# EAGLE design cnc_1_0_0 (EAGLE 6.2)
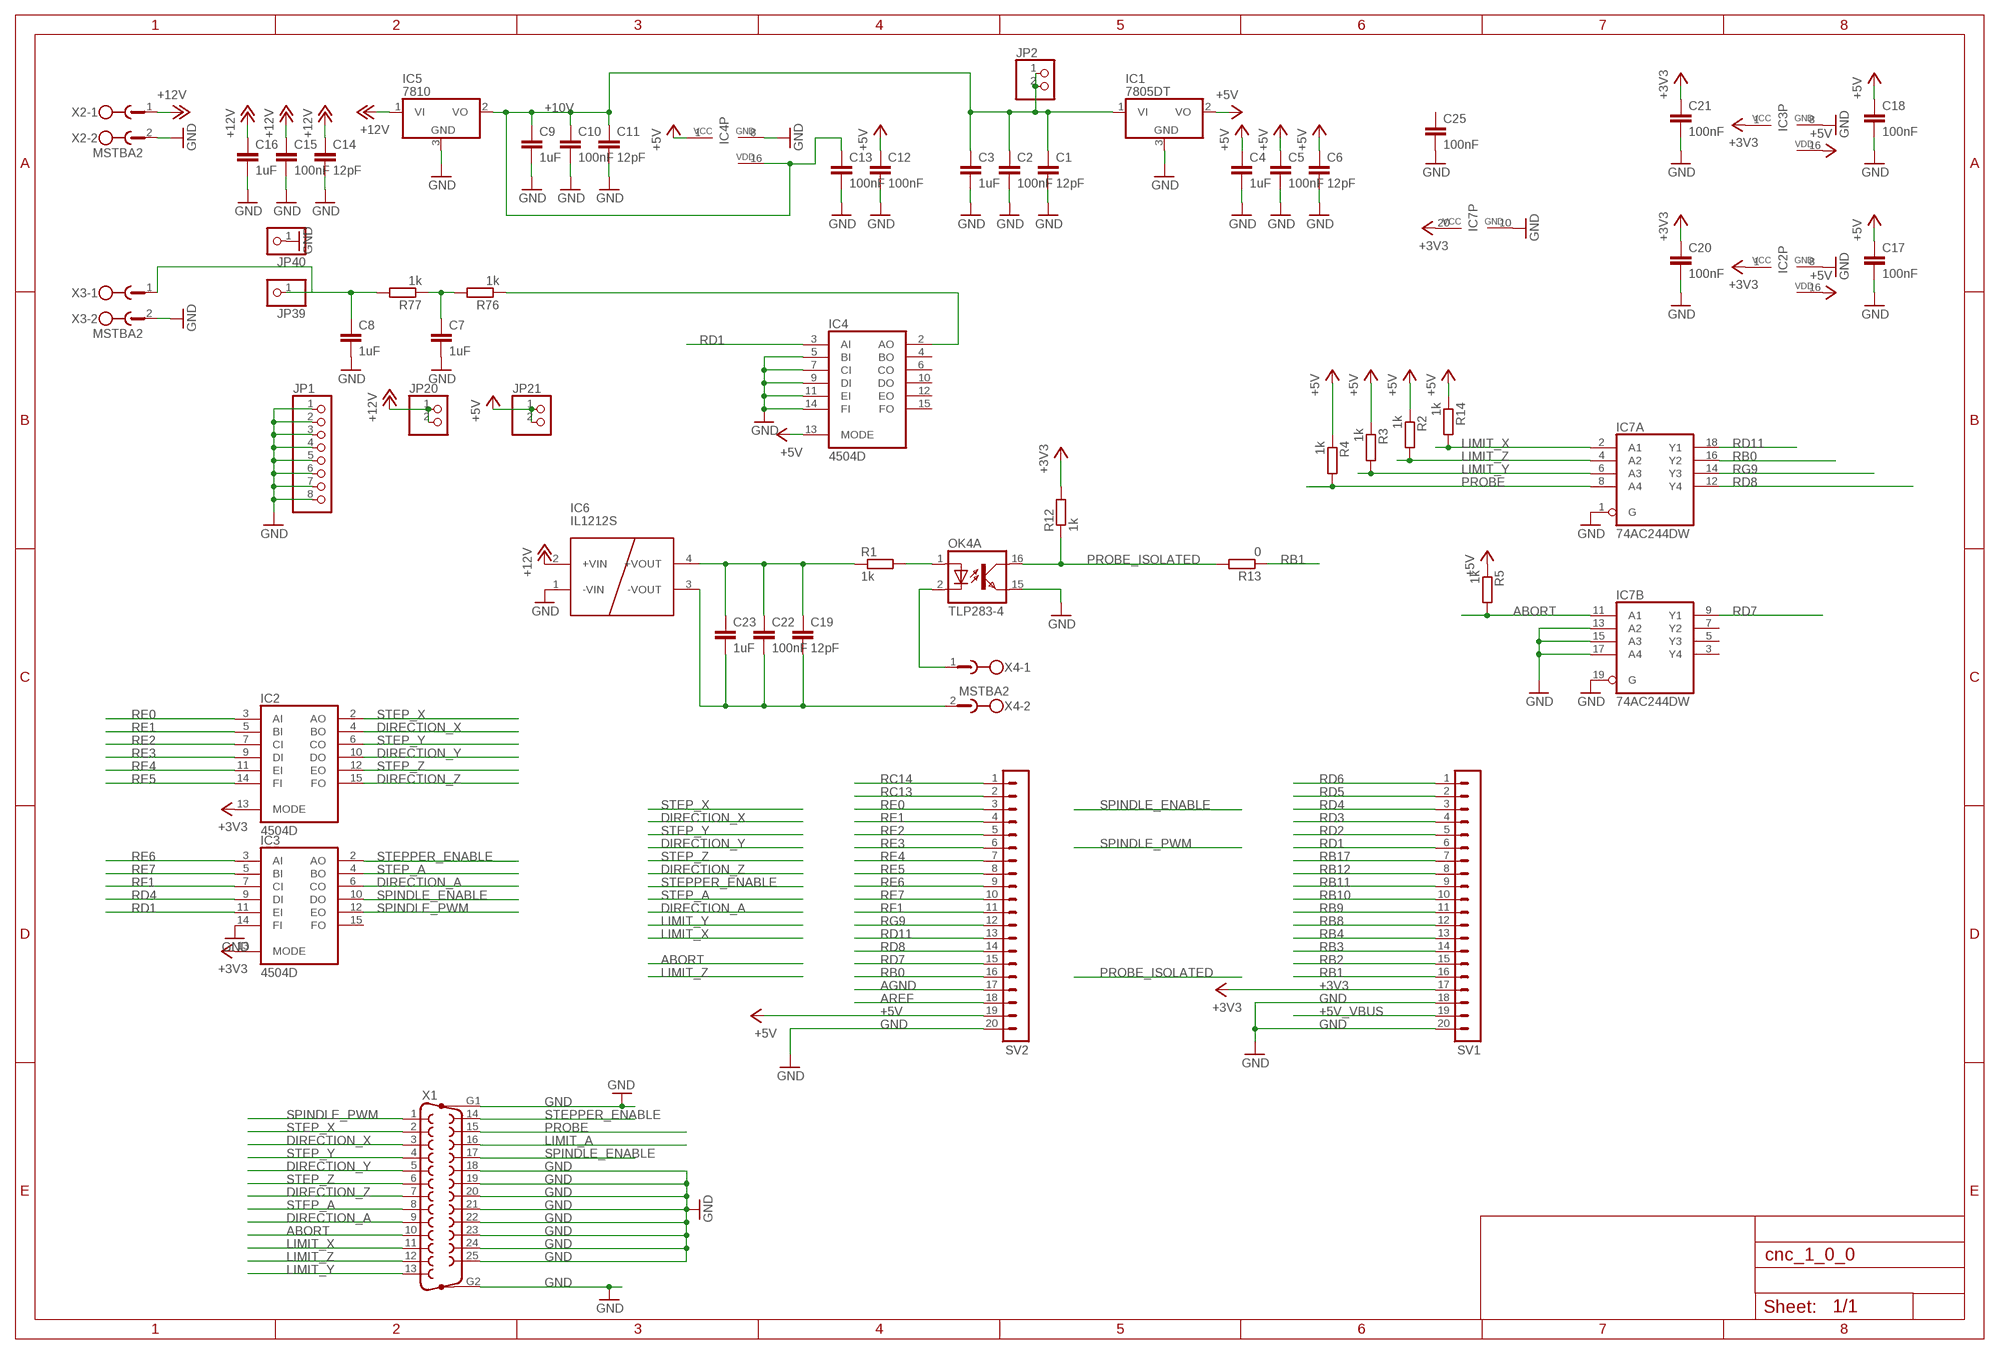
[diagram p0: schematic, sheet 1]

## Parts
C1  12pF  C-EUC0805K  [C0805K]
C2  100nF  C-EUC0805K  [C0805K]
C3  1uF  C-EUC0805K  [C0805K]
C4  1uF  C-EUC0805K  [C0805K]
C5  100nF  C-EUC0805K  [C0805K]
C6  12pF  C-EUC0805K  [C0805K]
C7  1uF  C-EUC0805K  [C0805K]
C8  1uF  C-EUC0805K  [C0805K]
C9  1uF  C-EUC0805K  [C0805K]
C10  100nF  C-EUC0805K  [C0805K]
C11  12pF  C-EUC0805K  [C0805K]
C12  100nF  C-EUC0805K  [C0805K]
C13  100nF  C-EUC0805K  [C0805K]
C14  12pF  C-EUC0805K  [C0805K]
C15  100nF  C-EUC0805K  [C0805K]
C16  1uF  C-EUC0805K  [C0805K]
C17  100nF  C-EUC0805K  [C0805K]
C18  100nF  C-EUC0805K  [C0805K]
C19  12pF  C-EUC0805K  [C0805K]
C20  100nF  C-EUC0805K  [C0805K]
C21  100nF  C-EUC0805K  [C0805K]
C22  100nF  C-EUC0805K  [C0805K]
C23  1uF  C-EUC0805K  [C0805K]
C25  100nF  C-EUC0805K  [C0805K]
IC1  7805DT  [TO252]
IC2  4504D  [SO16]
IC3  4504D  [SO16]
IC4  4504D  [SO16]
IC5  7810  7805DT  [TO252]
IC6  IL1212S  IL0512S  [SIL4]
IC7  74AC244DW  [SO20W]
JP1  PINHD-1X8  [1X08]
JP2  PINHD-1X2  [1X02]
JP20  PINHD-1X2  [1X02]
JP21  PINHD-1X2  [1X02]
JP39  PINHD-1X1  [1X01]
JP40  PINHD-1X1  [1X01]
OK4  TLP283-4  [MINI-FLAT-16]
R1  1k  R-EU_R0805  [R0805]
R2  1k  R-EU_R0805  [R0805]
R3  1k  R-EU_R0805  [R0805]
R4  1k  R-EU_R0805  [R0805]
R5  1k  R-EU_R0805  [R0805]
R12  1k  R-EU_R0805  [R0805]
R13  0  R-EU_R0805  [R0805]
R14  1k  R-EU_R0805  [R0805]
R76  1k  R-EU_R0805  [R0805]
R77  1k  R-EU_R0805  [R0805]
SV1  MA20-1  [MA20-1]
SV2  MA20-1  [MA20-1]
X1  F25HP  [F25HP]
X2  MSTBA2  [MSTBA2]
X3  MSTBA2  [MSTBA2]
X4  MSTBA2  [MSTBA2]

## Nets
+3V3: C20.1 C21.1 IC2.1(VCC) IC2.13(MODE) IC3.1(VCC) IC3.13(MODE) IC7.20(P:VCC) R12.2 SV1.17
+5V: C4.1 C5.1 C6.1 C12.1 C17.1 C18.1 IC1.2(VO) IC2.16(VDD) IC3.16(VDD) IC4.1(VCC) IC4.13(MODE) JP21.1 JP21.2 R2.1 R3.1 R4.1 R5.1 R14.1 SV2.19
+5V_VBUS: SV1.19
+10V: C1.1 C2.1 C3.1 C9.1 C10.1 C11.1 C13.1 IC1.1(VI) IC4.16(VDD) IC5.2(VO) JP2.1 JP2.2
+10V1: C19.1 C22.1 C23.1 IC6.4(+VOUT) R1.1
+12V: C14.1 C15.1 C16.1 IC5.1(VI) IC6.2(+VIN) JP20.1 JP20.2 X2.1
ABORT: IC7.11(B:A1) R5.2 X1.10
AGND: SV2.17
AREF: SV2.18
DIRECTION_A: IC3.6(CO) X1.9
DIRECTION_X: IC2.4(BO) X1.3
DIRECTION_Y: IC2.10(DO) X1.5
DIRECTION_Z: IC2.15(FO) X1.7
GND: C1.2 C2.2 C3.2 C4.2 C5.2 C6.2 C7.2 C8.2 C9.2 C10.2 C11.2 C12.2 C13.2 C14.2 C15.2 C16.2 C17.2 C18.2 C20.2 C21.2 C25.2 IC1.3(GND) IC2.8(GND) IC3.8(GND) IC3.14(FI) IC4.5(BI) IC4.7(CI) IC4.8(GND) IC4.9(DI) IC4.11(EI) IC4.14(FI) IC5.3(GND) IC6.1(-VIN) IC7.1(A:G) IC7.10(P:GND) IC7.13(B:A2) IC7.15(B:A3) IC7.17(B:A4) IC7.19(B:G) JP1.1 JP1.2 JP1.3 JP1.4 JP1.5 JP1.6 JP1.7 JP1.8 JP40.1 OK4.15(A:EMIT) SV1.18 SV1.20 SV2.20 X1.18 X1.19 X1.20 X1.21 X1.22 X1.23 X1.24 X1.25 X1.G1 X1.G2 X2.2 X3.2
LIMIT_A: X1.16
LIMIT_X: IC7.2(A:A1) R14.2 X1.11
LIMIT_Y: IC7.6(A:A3) R3.2 X1.13
LIMIT_Z: IC7.4(A:A2) R2.2 X1.12
N$3: C7.1 R76.2 R77.1
N$5: OK4.1(A:A) R1.2
N$6: OK4.2(A:C) X4.1
N$7: C19.2 C22.2 C23.2 IC6.3(-VOUT) X4.2
N$45: C8.1 JP39.1 R77.2 X3.1
N$47: IC4.2(AO) R76.1
PROBE: IC7.8(A:A4) R4.2 X1.15
PROBE_ISOLATED: OK4.16(A:COL) R12.1 R13.2
RB0: IC7.16(A:Y2) SV2.16
RB1: R13.1 SV1.16
RB2: SV1.15
RB3: SV1.14
RB4: SV1.13
RB8: SV1.12
RB9: SV1.11
RB10: SV1.10
RB11: SV1.9
RB12: SV1.8
RB17: SV1.7
RC13: SV2.2
RC14: SV2.1
RD1: IC3.11(EI) IC4.3(AI) SV1.6
RD2: SV1.5
RD3: SV1.4
RD4: IC3.9(DI) SV1.3
RD5: SV1.2
RD6: SV1.1
RD7: IC7.9(B:Y1) SV2.15
RD8: IC7.12(A:Y4) SV2.14
RD11: IC7.18(A:Y1) SV2.13
RE0: IC2.3(AI) SV2.3
RE1: IC2.5(BI) SV2.4
RE2: IC2.7(CI) SV2.5
RE3: IC2.9(DI) SV2.6
RE4: IC2.11(EI) SV2.7
RE5: IC2.14(FI) SV2.8
RE6: IC3.3(AI) SV2.9
RE7: IC3.5(BI) SV2.10
RF1: IC3.7(CI) SV2.11
RG9: IC7.14(A:Y3) SV2.12
SPINDLE_ENABLE: IC3.10(DO) X1.17
SPINDLE_PWM: IC3.12(EO) X1.1
STEP_A: IC3.4(BO) X1.8
STEP_X: IC2.2(AO) X1.2
STEP_Y: IC2.6(CO) X1.4
STEP_Z: IC2.12(EO) X1.6
STEPPER_ENABLE: IC3.2(AO) X1.14
Unconnected: C25.1 IC3.15(FO) IC4.4(BO) IC4.6(CO) IC4.10(DO) IC4.12(EO) IC4.15(FO) IC7.3(B:Y4) IC7.5(B:Y3) IC7.7(B:Y2) OK4.3(B:A) OK4.4(B:C) OK4.5(C:A) OK4.6(C:C) OK4.7(D:A) OK4.8(D:C) OK4.9(D:EMIT) OK4.10(D:COL) OK4.11(C:EMIT) OK4.12(C:COL) OK4.13(B:EMIT) OK4.14(B:COL)

## Library data of the parts
C1-C23 C25 = rcl:C-EU: CAPACITOR, European symbol
IC1 IC5 = linear:78*: Positive VOLTAGE REGULATOR Source: http://cache.national.com/ds/LM/LM78L05.pdf http://www.fairchildsemi.com/ds/LM/LM7805.pdf
IC2-IC4 = 45xx:4504: TTL or CMOS to CMOS hex LEVEL SHIFTER
IC6 = IsolatedDCDC:IL0512S
IC7 = 74xx-eu:74*244: Octal BUFFER and LINE DRIVER, 3-state
JP1 = pinhead:PINHD-1X8: PIN HEADER
JP2 JP20 JP21 = pinhead:PINHD-1X2: PIN HEADER
JP39 JP40 = pinhead:PINHD-1X1: PIN HEADER
OK4 = optocoupler:TLP283-4: TOSHIBA PHOTOCOUPLER GaAs IRED & PHOTO-TRANSISTOR Source: http://www.semicon.toshiba.co.jp/td/en/Opto/Photocoupler/en_20050928_TLP283_datasheet.pdf; OC_FARNELL: unknown; OC_NEWARK: unknown
R1-R5 R12-R14 R76 R77 = rcl:R-EU_: RESISTOR, European symbol
SV1 SV2 = con-lstb:MA20-1: PIN HEADER; OC_FARNELL: unknown; OC_NEWARK: unknown
X1 = con-subd:F25HP: SUB-D; OC_FARNELL: unknown; OC_MOUSER: https://www.mouser.de/ProductDetail/636-182-025-113R531; OC_NEWARK: unknown
X2-X4 = con-phoenix-508:MSTBA2: PHOENIX; MF: FARNELL; MPN: 1757242; OC_FARNELL: 3705171; OC_NEWARK: 71C4161

## Board
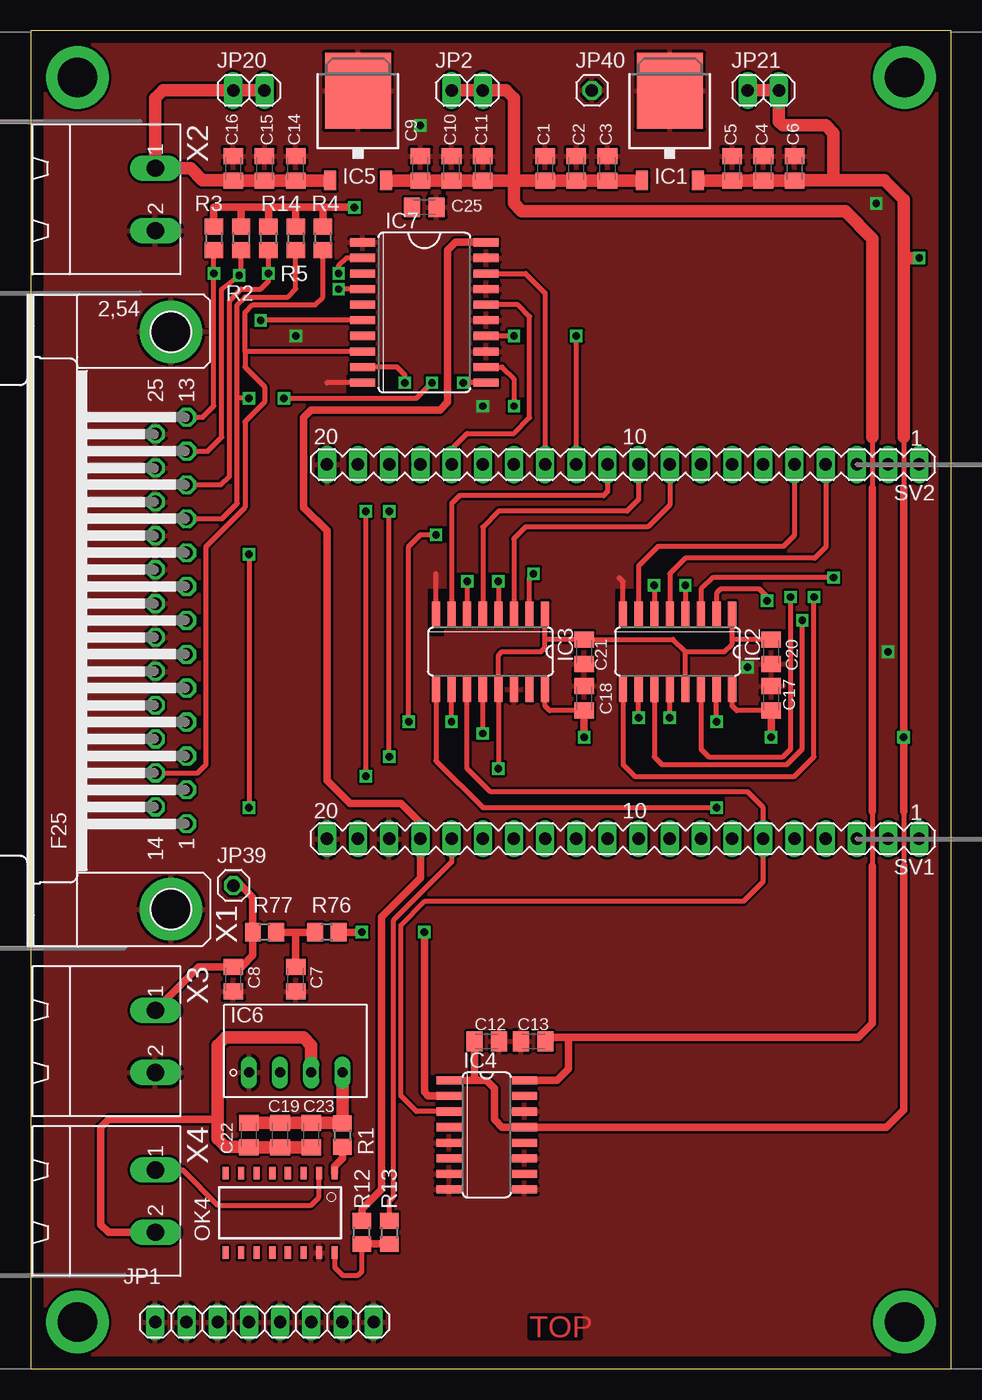
[diagram p1: board, top side]
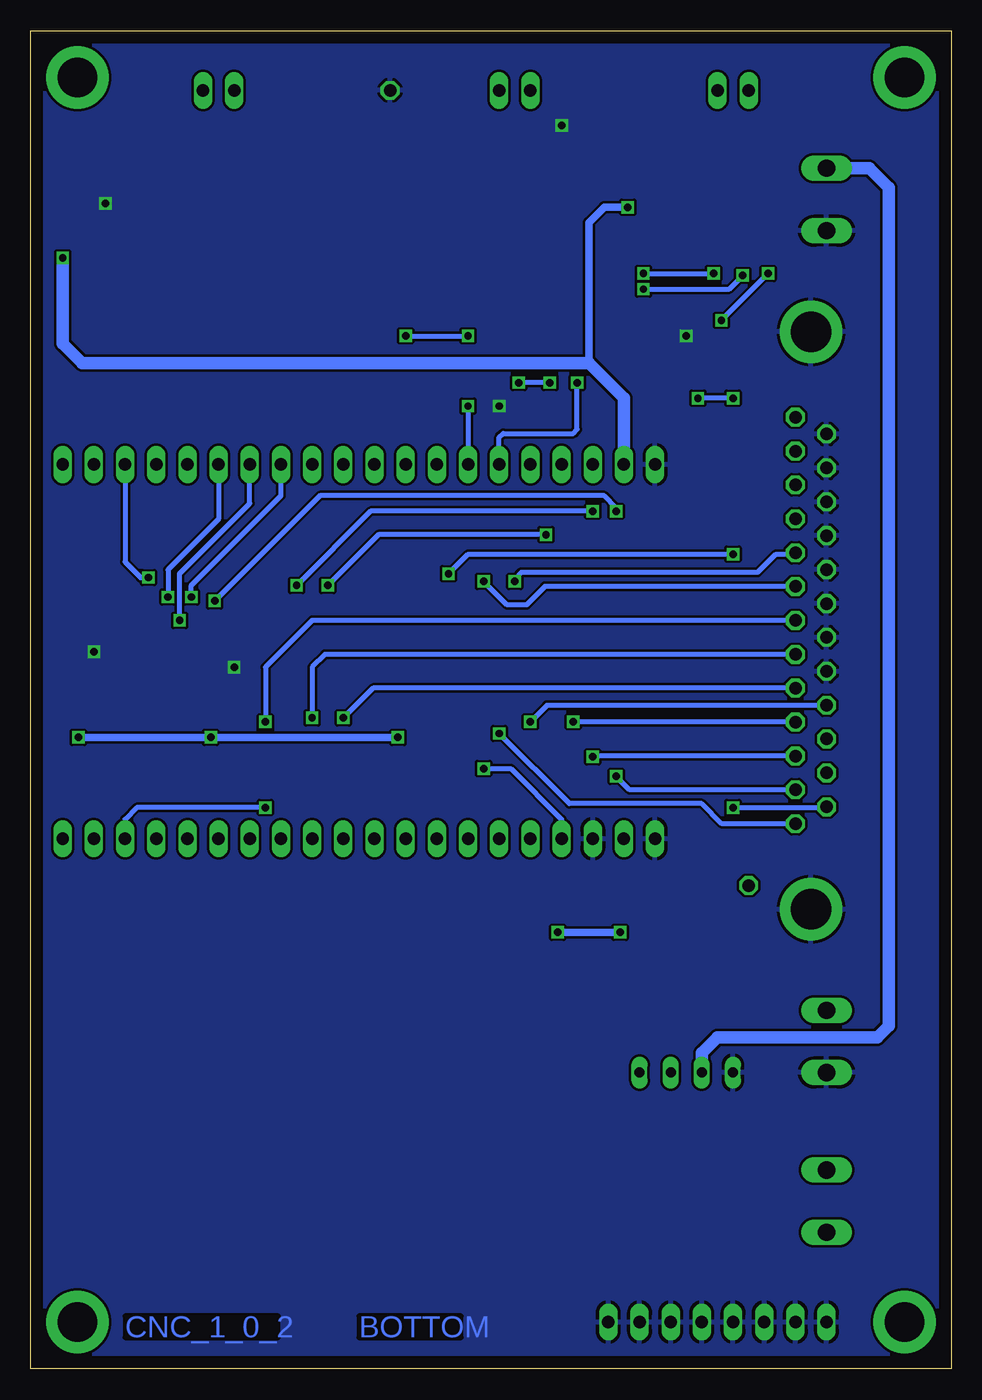
[diagram p2: board, bottom side, seen from below]

Size 75 x 109 mm. Coordinates in mm from the lower left corner, seen from the top.
Outline: 0,0 75,0 75,109 0,109 0,0
Copper layers (1*16): Top 0.035mm / dielectric 1.5mm / Bottom 0.035mm
Design rules: minimum track width 16mil, minimum drill 0.6mm, track to track 8mil, track to pad 8mil, pad to pad 8mil, via to via 8mil, smd to smd 8mil, copper to edge 40mil, drill to drill 8mil, minimum pad ring 10mil, minimum via ring 8mil, stop-mask expansion 4mil, vias tented up to drill 0mil, thermal gap 10mil
tRestrict: area 32.4,59.7 to 33.7,63.5; area 47.6,59.7 to 48.9,63.5; area 25.7,79.7 to 29.5,81

### Footprints (pad centres in the part's own frame; a part is rotated, then mirrored left to right if it is on the bottom)
C0805K = smd 1.3 x 1.6: 1 -1,0; 2 1,0
TO252 = smd 1 x 1.6: 1 -2.28,-4.8; 2 2.28,-4.8 | smd 5.4 x 6.2: 3 0,2.5
SO16 = smd 0.66 x 2.032: 1 -4.445,-3.073; 2 -3.175,-3.073; 3 -1.905,-3.073; 4 -0.635,-3.073; 5 0.635,-3.073; 6 1.905,-3.073; 7 3.175,-3.073; 8 4.445,-3.073; 9 4.445,3.073; 10 3.175,3.073; 11 1.905,3.073; 12 0.635,3.073; 13 -0.635,3.073; 14 -1.905,3.073; 15 -3.175,3.073; 16 -4.445,3.073
SIL4 = drill 0.813 long: 1 0,0; 2 2.54,0; 3 5.08,0; 4 7.62,0
SO20W = smd 0.66 x 2.032: 1 -5.715,-5.029; 2 -4.445,-5.029; 3 -3.175,-5.029; 4 -1.905,-5.029; 5 -0.635,-5.029; 6 0.635,-5.029; 7 1.905,-5.029; 8 3.175,-5.029; 9 4.445,-5.029; 10 5.715,-5.029; 11 5.715,5.029; 12 4.445,5.029; 13 3.175,5.029; 14 1.905,5.029; 15 0.635,5.029; 16 -0.635,5.029; 17 -1.905,5.029; 18 -3.175,5.029; 19 -4.445,5.029; 20 -5.715,5.029
1X08 = drill 1.016 long: 1 -8.89,0; 2 -6.35,0; 3 -3.81,0; 4 -1.27,0; 5 1.27,0; 6 3.81,0; 7 6.35,0; 8 8.89,0
1X02 = drill 1.016 long: 1 -1.27,0; 2 1.27,0
1X01 = drill 1.016 octagon: 1 0,0
MINI-FLAT-16 = smd 1 x 0.5: 1 -3.24,4.445; 2 -3.24,3.175; 3 -3.24,1.905; 4 -3.24,0.635; 5 -3.24,-0.635; 6 -3.24,-1.905; 7 -3.24,-3.175; 8 -3.24,-4.445; 9 3.24,-4.445; 10 3.24,-3.175; 11 3.24,-1.905; 12 3.24,-0.635; 13 3.24,0.635; 14 3.24,1.905; 15 3.24,3.175; 16 3.24,4.445
R0805 = smd 1.3 x 1.5: 1 -0.95,0; 2 0.95,0
MA20-1 = drill 1.016 long: 1 -24.13,0; 2 -21.59,0; 3 -19.05,0; 4 -16.51,0; 5 -13.97,0; 6 -11.43,0; 7 -8.89,0; 8 -6.35,0; 9 -3.81,0; 10 -1.27,0; 11 1.27,0; 12 3.81,0; 13 6.35,0; 14 8.89,0; 15 11.43,0; 16 13.97,0; 17 16.51,0; 18 19.05,0; 19 21.59,0; 20 24.13,0
F25HP = drill 1.016 octagon: 1 -16.561,-1.27; 2 -13.792,-1.27; 3 -11.049,-1.27; 4 -8.28,-1.27; 5 -5.512,-1.27; 6 -2.769,-1.27; 7 0,-1.27; 8 2.769,-1.27; 9 5.512,-1.27; 10 8.28,-1.27; 11 11.049,-1.27; 12 13.792,-1.27; 13 16.561,-1.27; 14 -15.189,1.27; 15 -12.421,1.27; 16 -9.652,1.27; 17 -6.909,1.27; 18 -4.14,1.27; 19 -1.372,1.27; 20 1.372,1.27; 21 4.14,1.27; 22 6.909,1.27; 23 9.652,1.27; 24 12.421,1.27; 25 15.189,1.27 | drill 3.302 pad 5.08: G1 -23.52,0; G2 23.52,0
MSTBA2 = drill 1.397 long: 1 -2.54,5.08; 2 2.54,5.08

### Placement (x,y rotation side)
C1  41.91,97.79 90 top
C2  44.45,97.79 90 top
C3  46.99,97.79 90 top
C4  59.69,97.79 90 top
C5  57.15,97.79 90 top
C6  62.23,97.79 90 top
C7  21.59,31.75 270 top
C8  16.51,31.75 270 top
C9  31.75,97.79 90 top
C10  34.29,97.79 90 top
C11  36.83,97.79 90 top
C12  37.15,26.67 0 top
C13  40.96,26.67 180 top
C14  21.59,97.79 90 top
C15  19.05,97.79 90 top
C16  16.51,97.79 90 top
C17  60.33,54.61 90 top
C18  45.09,54.61 90 top
C19  20.32,19.05 270 top
C20  60.33,58.42 270 top
C21  45.09,58.42 270 top
C22  17.78,19.05 270 top
C23  22.86,19.05 270 top
C25  32.07,94.61 0 top
IC1  52.07,101.6 0 top
IC2  52.7,58.42 180 top
IC3  37.47,58.42 180 top
IC4  37.15,19.05 270 top
IC5  26.67,101.6 0 top
IC6  17.78,24.13 0 top
IC7  32.07,86.04 270 top
JP1  19.05,3.81 0 top
JP2  35.56,104.14 0 top
JP20  17.78,104.14 0 top
JP21  59.69,104.14 0 top
JP39  16.51,39.37 0 top
JP40  45.72,104.14 0 top
OK4  20.32,12.7 270 top
R1  25.4,19.05 270 top
R2  17.14,92.08 270 top
R3  14.92,92.08 270 top
R4  23.81,92.08 270 top
R5  21.59,92.08 270 top
R12  26.99,11.11 90 top
R13  29.21,11.11 270 top
R14  19.37,92.08 270 top
R76  24.13,35.56 180 top
R77  19.05,35.56 180 top
SV1  48.26,43.18 180 top
SV2  48.26,73.66 180 top
X1  11.43,60.96 90 top
X2  5.08,95.25 270 top
X3  5.08,26.67 270 top
X4  5.08,13.65 270 top

### Tracks (layer width: path | path; a pad name or v marks a point on that pad's centre or on a via)
+3V3  (via drill 0.6)
  Top 0.406: 41.91,59.37 41.91,58.74 41.59,58.42 38.42,58.42 38.1,58.1 IC3.13 v38.1,48.9 | 41.91,59.37 IC3.1 | IC2.13 53.34,58.42 | 53.34,58.42 56.52,58.42 57.15,59.05 57.15,59.37 | 57.15,59.37 IC2.1 | C20.1 57.2,59.42 57.15,59.37 | 41.91,59.37 41.96,59.42 C21.1 52.34,59.42 53.34,58.42
  Top 0.61: R12.2 26.98,13.02 28.57,14.61 28.57,36.83 31.75,40.01 SV1.17 31.75,44.45 30.16,46.04 26.04,46.04 24.13,47.94 24.13,68.26 22.23,70.17 22.23,77.47 22.86,78.11 33.34,78.11 33.97,78.74 33.97,91.12 34.61,91.76 IC7.20
  Bottom 0.406: v38.1,48.9 35.88,48.9 31.75,44.77 SV1.17
+5V  (via drill 0.6)
  Top 0.406: 71.12,75.88 71.12,71.75 | 71.12,45.4 71.12,40.96 | C18.1 42.27,53.61 41.91,53.98 IC3.16 | C17.1 57.52,53.61 57.15,53.98 IC2.16
  Top 0.61: 71.12,40.96 71.12,21.11 69.7,19.68 IC4.13 38.42,19.68 37.78,20.32 37.78,22.86 37.15,23.5 36.2,23.5 | 36.2,23.5 IC4.1 | C12.1 36.15,23.54 36.2,23.5 | 71.12,71.75 v71.12,51.44 71.12,45.4 | C17.1 v60.33,51.44 | v45.09,51.44 C18.1 | 23.81,94.61 21.59,94.61 | 21.59,94.61 19.37,94.61 | 19.37,94.61 17.14,94.61 | 17.14,94.61 14.92,94.61 R3.1 | R2.1 17.14,94.61 | R14.1 19.37,94.61 | R5.1 21.59,94.61 | R4.1 23.81,94.61 | 23.81,94.61 v26.35,94.61
  Top 1.016: IC1.2 C5.1 58.69,96.79 58.74,96.84 59.64,96.84 C4.1 C6.1 62.28,96.84 65.41,96.84 | JP21.1 JP21.2 60.96,101.6 61.28,101.28 64.77,101.28 65.41,100.65 65.41,96.84 | 65.41,96.84 69.53,96.84 71.12,95.25 71.12,90.81 | 71.12,90.81 71.12,75.88 | v72.39,90.49 71.44,90.49 71.12,90.81
  Bottom 0.61: v71.12,51.44 v60.33,51.44 v45.09,51.44 | v26.35,94.61 28.26,94.61 29.53,93.34 29.53,81.92
  Bottom 1.016: v72.39,90.49 72.39,83.5 70.8,81.92 29.53,81.92 26.67,79.06 SV2.19
+10V
  Top 0.406: 68.58,75.88 68.58,71.75 | 68.58,45.4 68.58,40.96
  Top 0.61: 68.58,40.96 68.58,28.13 67.44,26.99 43.81,26.99 | 43.81,26.99 42.27,26.99 C13.1 | IC4.16 42.86,23.5 43.81,24.45 43.81,26.99 | 68.58,71.75 68.58,45.4
  Top 1.016: IC5.2 C9.1 C10.1 C11.1 39.37,96.79 | 39.37,96.79 C1.1 C2.1 C3.1 IC1.1 | 39.37,96.79 39.37,103.5 38.73,104.14 JP2.2 JP2.1 | 39.37,96.79 39.37,94.93 40.01,94.3 66.36,94.3 68.58,92.08 68.58,75.88
+10V1
  Top 1.016: IC6.4 R1.1 25.35,20.05 C23.1 C19.1 C22.1
+12V
  Top 1.016: IC5.1 C14.1 C15.1 C16.1 16.46,96.84 13.97,96.84 13.02,97.79 X2.1 10.16,103.5 10.79,104.14 JP20.1 JP20.2
  Bottom 1.016: IC6.2 20.32,25.72 19.05,26.99 6.03,26.99 5.08,27.94 5.08,96.2 6.67,97.79 X2.1
ABORT  (via drill 0.6)
  Top 0.406: X1.10 15.58,69.24 16.83,70.48 16.83,79.06 | 16.83,79.06 16.83,86.68 17.46,87.31 20.95,87.31 21.59,87.95 R5.2 | IC7.11 v35.24,80.33 | v17.78,79.06 16.83,79.06 | v20.64,79.06 31.43,79.06 v32.7,80.33
  Bottom 0.406: v17.78,79.06 v20.64,79.06 | v32.7,80.33 v35.24,80.33
DIRECTION_A  (via drill 0.6)
  Top 0.406: 12.7,66.67 X1.9 | v35.56,64.14 IC3.6
  Bottom 0.406: v35.56,64.14 35.56,64.35 35.02,64.88 15.76,64.88 14.29,66.36 12.81,66.36 X1.9
DIRECTION_X  (via drill 0.6)
  Top 0.406: v29.21,49.85 v29.21,69.85 | v53.34,63.82 IC2.4
  Bottom 0.406: X1.3 29.15,49.91 v29.21,49.85 | v29.21,69.85 47.31,69.85 v53.34,63.82
DIRECTION_Y  (via drill 0.6)
  Top 0.406: v49.53,53.02 IC2.10
  Bottom 0.406: X1.5 47.1,55.45 v49.53,53.02
DIRECTION_Z  (via drill 0.6)
  Top 0.406: v55.88,52.7 IC2.15
  Bottom 0.406: X1.7 52.07,60.96 55.88,57.15 v55.88,52.7
GND  (via drill 0.6)
  Top 0.406: IC2.8 48.26,64.14 47.94,64.45 | IC3.8 33.02,64.77 | IC7.10 24.13,80.33
  other vias: 58.42,57.15 31.75,101.28 68.9,94.93 36.83,78.42 21.59,84.14 69.85,58.42
  pour Bottom: -2.54,110.49 27.94,110.49 27.94,115.57 49.53,115.57 49.53,110.49 77.47,110.49 77.47,-2.54 -2.54,-2.54
  pour Top: -2.54,110.49 1.27,110.49 1.27,115.57 19.05,115.57 19.05,110.49 77.47,110.49 77.47,-2.54 -2.54,-2.54
LIMIT_X  (via drill 0.6)
  Top 0.406: X1.11 15.49,72.01 16.19,72.71 16.19,87 17.14,87.95 18.73,87.95 19.37,88.58 v19.37,89.22 R14.2 | IC7.2 25.72,90.49 25.08,89.85 v25.08,89.22
  Bottom 0.406: v25.08,89.22 v19.37,89.22
LIMIT_Y  (via drill 0.6)
  Top 0.406: X1.13 14.02,77.52 14.92,78.42 v14.92,89.22 R3.2 | IC7.6 v18.73,85.41
  Bottom 0.406: v18.73,85.41 v14.92,89.22
LIMIT_Z  (via drill 0.6)
  Top 0.406: X1.12 14.43,74.75 15.56,75.88 15.56,87.95 v16.99,89.06 17.14,89.53 R2.2 | IC7.4 v25.08,87.95
  Bottom 0.406: v25.08,87.95 18.1,87.95 v16.99,89.06
N$1  (via drill 3.2 pad 5.1)
  other vias: 71.2,3.8
N$2  (via drill 3.2 pad 5.1)
  other vias: 71.2,105.2
N$3
  Top 0.61: R77.1 21.59,35.56 | 21.59,35.56 R76.2 | C7.1 21.59,35.56
N$4  (via drill 3.2 pad 5.1)
  other vias: 3.8,105.2
N$5
  Top 0.61: R1.2 25.4,17.14 24.77,16.51 OK4.1
N$6
  Top 0.406: X4.1 12.38,16.19 15.24,13.34 22.86,13.34 23.5,13.97 OK4.2
N$7
  Top 0.61: X4.2 6.35,11.11 5.71,11.75 5.71,19.68 6.35,20.32 15.24,20.32
  Top 1.016: IC6.3 22.86,26.35 22.23,26.99 15.88,26.99 15.24,26.35 15.24,20.32 15.24,18.73 15.88,18.1 17.73,18.1 C22.2 C19.2 C23.2
N$8  (via drill 3.2 pad 5.1)
  other vias: 3.8,3.8
N$45
  Top 0.61: X3.1 13.7,32.75 C8.1 17.19,32.75 18.1,33.66 R77.2 18.1,38.42 17.14,39.37 JP39.1
N$47  (via drill 0.6)
  Top 0.61: v26.99,35.56 R76.1 | IC4.2 32.38,22.23 32.07,22.54 v32.07,35.56
  Bottom 0.61: v32.07,35.56 v26.99,35.56
PROBE
  Top 0.406: X1.15 13.61,48.54 14.29,49.21 14.29,66.99 17.46,70.17 17.46,77.15 19.05,78.74 19.05,80.01 17.46,81.6 17.46,82.87 | 17.46,82.87 17.46,86.04 18.1,86.68 23.18,86.68 23.81,87.31 R4.2 | IC7.8 17.46,82.87
PROBE_ISOLATED
  Top 0.406: OK4.16 24.77,8.26 25.4,7.62 26.67,7.62 26.99,7.94 R12.1
  Top 0.61: R12.1 R13.2
RB0
  Top 0.406: SV2.16 34.29,74.93 35.56,76.2 39.37,76.2 40.64,77.47 40.64,85.72 39.69,86.68 IC7.16
RB1
  Top 0.406: SV1.16 34.29,41.27 29.53,36.51 29.53,13.97 29.21,13.65 R13.1
RD1
  Top 0.406: IC4.3 31.43,20.95 30.16,22.23 30.16,36.12 32.15,38.1 58.1,38.1 59.69,39.69 SV1.6 59.69,45.72 58.42,46.99 37.47,46.99 35.56,48.9 IC3.11
RD4  (via drill 0.6)
  Top 0.406: IC3.9 33.02,49.53 36.83,45.72 v55.88,45.72
  Bottom 0.406: v55.88,45.72 66.36,45.72 67.31,44.77 SV1.3
RD7  (via drill 0.6)
  Top 0.406: v30.48,80.33 30.48,80.96 29.84,81.6 IC7.9
  Bottom 0.406: SV2.15 36.83,75.88 36.51,76.2 30.8,76.2 30.48,76.52 v30.48,80.33
RD8  (via drill 0.6)
  Top 0.406: IC7.12 38.42,81.6 39.37,80.64 v39.37,78.42
  Bottom 0.406: v39.37,78.42 SV2.14
RD11
  Top 0.406: IC7.18 40.32,89.22 41.91,87.63 SV2.13
RE0  (via drill 0.6)
  Top 0.406: v65.41,64.45 55.56,64.45 54.61,63.5 IC2.3
  Bottom 0.406: SV2.3 67.31,65.72 66.04,64.45 v65.41,64.45
RE1
  Top 0.406: SV2.4 64.77,66.94 63.87,66.04 53.34,66.04 52.07,64.77 IC2.5
RE2
  Top 0.406: SV2.5 62.23,67.89 61.33,66.99 51.12,66.99 49.53,65.41 IC2.7
RE3  (via drill 0.6)
  Top 0.406: IC2.9 48.26,49.21 49.21,48.26 62.23,48.26 63.82,49.85 v63.82,62.87
  Bottom 0.406: SV2.6 59.69,69.22 63.82,65.09 v63.82,62.87
RE4  (via drill 0.6)
  Top 0.406: IC2.11 50.8,49.85 51.44,49.21 61.59,49.21 62.87,50.48 v62.87,60.96
  Bottom 0.406: v62.87,60.96 62.87,64.77 57.15,70.48 SV2.7
RE5  (via drill 0.6)
  Top 0.406: IC2.14 54.61,50.48 55.24,49.85 61.28,49.85 61.91,50.48 v61.91,62.87
  Bottom 0.406: v61.91,62.87 61.91,63.82 54.61,71.12 SV2.8
RE6
  Top 0.406: SV2.9 52.07,70.38 50.27,68.58 40.32,68.58 39.37,67.63 IC3.3
RE7
  Top 0.406: SV2.10 49.53,70.8 48.58,69.85 38.1,69.85 36.83,68.58 IC3.5
RF1
  Top 0.406: SV2.11 46.99,71.44 46.67,71.12 34.92,71.12 34.29,70.48 IC3.7
RG9  (via drill 0.6)
  Top 0.406: SV2.12 v44.45,84.14 | v39.37,84.14 IC7.14
  Bottom 0.406: v44.45,84.14 v39.37,84.14
SPINDLE_ENABLE  (via drill 0.6)
  Top 0.406: v34.29,52.7 IC3.10
  Bottom 0.406: X1.17 32.94,54.05 v34.29,52.7
SPINDLE_PWM  (via drill 0.6)
  Top 0.406: v36.83,51.75 IC3.12
  Bottom 0.406: X1.1 18.68,44.4 20.32,46.04 31.11,46.04 v36.83,51.75
STEP_A  (via drill 0.6)
  Top 0.406: v38.1,64.14 IC3.4
  Bottom 0.406: X1.8 33.11,63.73 34.61,62.23 36.2,62.23 v38.1,64.14
STEP_X  (via drill 0.6)
  Top 0.406: v27.3,48.26 v27.3,69.85 | v60.01,62.55 60.01,62.87 59.37,63.5 56.2,63.5 55.88,63.18 IC2.2
  Bottom 0.406: X1.2 26.21,47.17 v27.3,48.26 | v27.3,69.85 27.3,70.17 28.26,71.12 51.44,71.12 v60.01,62.55
STEP_Y  (via drill 0.6)
  Top 0.406: v30.8,52.7 30.8,66.99 31.75,67.94 v33.02,67.94 | v50.8,63.82 IC2.6
  Bottom 0.406: X1.4 30.77,52.68 v30.8,52.7 | v33.02,67.94 46.67,67.94 v50.8,63.82
STEP_Z  (via drill 0.6)
  Top 0.406: v52.07,53.02 IC2.12
  Bottom 0.406: X1.6 51.03,58.19 52.07,57.15 v52.07,53.02
STEPPER_ENABLE  (via drill 0.6)
  Top 0.406: IC3.2 40.64,64.45 v40.96,64.77 | v17.78,66.36 v17.78,45.72
  Bottom 0.406: v40.96,64.77 39.37,66.36 v17.78,66.36 | v17.78,45.72 10.21,45.72 X1.14

### Text on the board
Top: TOP
Bottom: BOTTOM | CNC_1_0_2